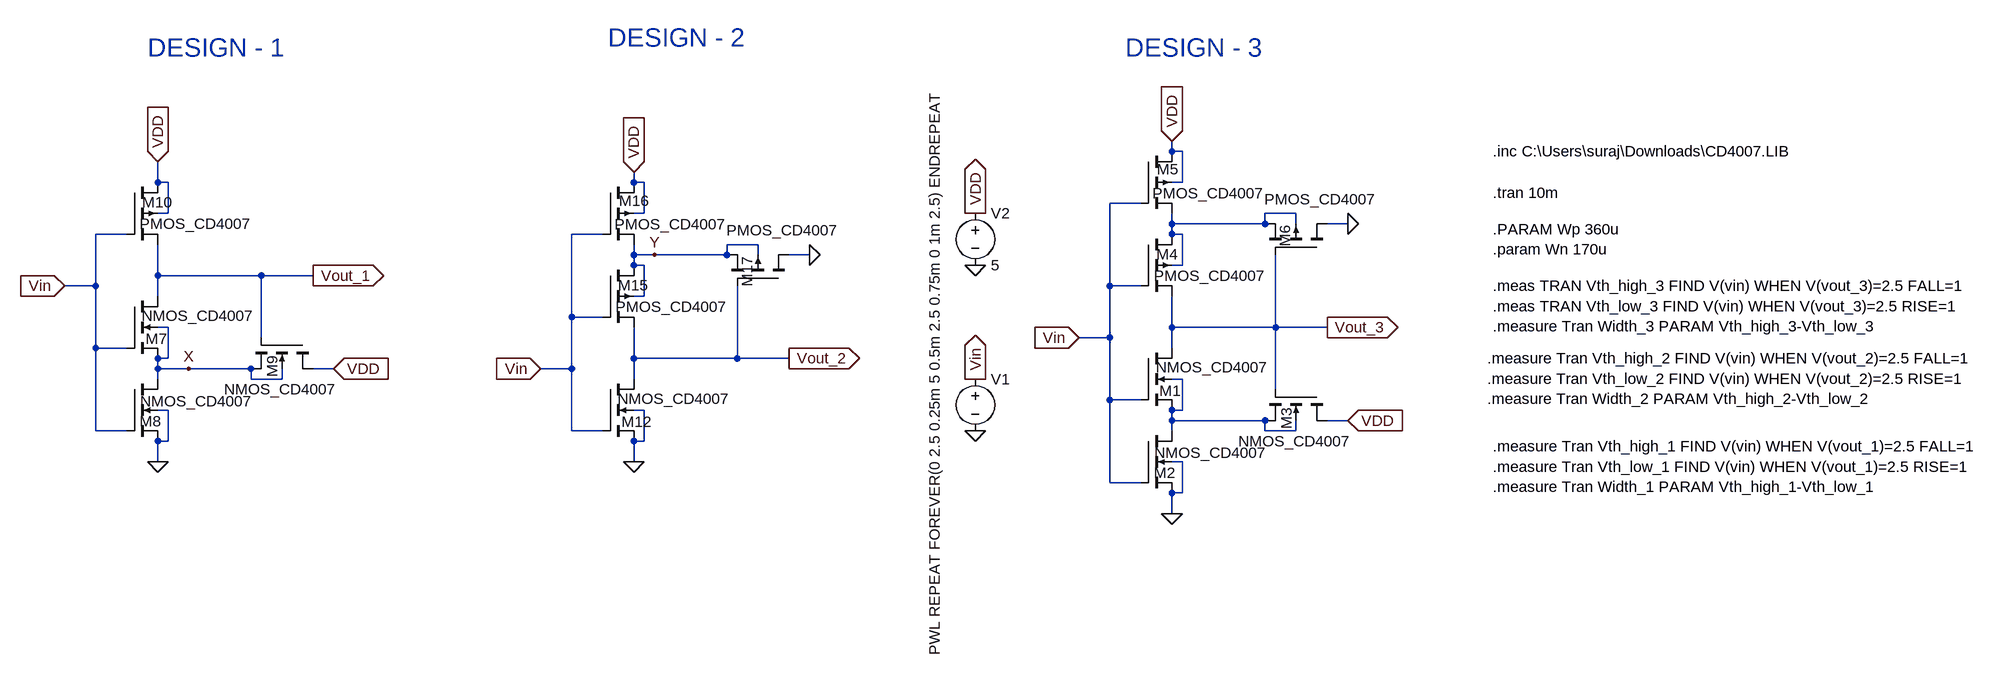
[diagram p0: schematic Schmitt_CD4007.asc]
Schmitt_CD4007.asc, the LTspice schematic file:
Version 4
SHEET 1 1564 1032
WIRE 176 -160 176 -176
WIRE 192 -160 176 -160
WIRE -1392 -112 -1392 -144
WIRE -1376 -112 -1392 -112
WIRE -656 -112 -656 -128
WIRE -640 -112 -656 -112
WIRE 192 -112 192 -160
WIRE 192 -112 176 -112
WIRE 128 -80 80 -80
WIRE -1376 -64 -1376 -112
WIRE -1376 -64 -1392 -64
WIRE -640 -64 -640 -112
WIRE -640 -64 -656 -64
WIRE 368 -64 320 -64
WIRE 176 -48 176 -64
WIRE 320 -48 320 -64
WIRE 320 -48 176 -48
WIRE 368 -48 368 -64
WIRE 448 -48 416 -48
WIRE -1440 -32 -1488 -32
WIRE -704 -32 -752 -32
WIRE 176 -32 176 -48
WIRE 192 -32 176 -32
WIRE -464 -16 -512 -16
WIRE -656 0 -656 -16
WIRE -624 0 -656 0
WIRE -512 0 -512 -16
WIRE -512 0 -624 0
WIRE -464 0 -464 -16
WIRE -384 0 -416 0
WIRE -656 16 -656 0
WIRE -640 16 -656 16
WIRE 192 16 192 -32
WIRE 192 16 176 16
WIRE -1392 32 -1392 -16
WIRE -1232 32 -1392 32
WIRE -1152 32 -1232 32
WIRE -1488 48 -1488 -32
WIRE -1488 48 -1536 48
WIRE 80 48 80 -80
WIRE 128 48 80 48
WIRE -1392 64 -1392 32
WIRE -640 64 -640 16
WIRE -640 64 -656 64
WIRE -752 96 -752 -32
WIRE -704 96 -752 96
WIRE -1376 112 -1392 112
WIRE 176 112 176 64
WIRE 336 112 336 0
WIRE 336 112 176 112
WIRE 416 112 336 112
WIRE -1232 128 -1232 32
WIRE 80 128 80 48
WIRE 80 128 32 128
WIRE -1488 144 -1488 48
WIRE -1440 144 -1488 144
WIRE 176 144 176 112
WIRE -1376 160 -1376 112
WIRE -1376 160 -1392 160
WIRE -656 160 -656 112
WIRE -496 160 -496 48
WIRE -496 160 -656 160
WIRE -416 160 -496 160
WIRE -1392 176 -1392 160
WIRE -1344 176 -1392 176
WIRE -1248 176 -1344 176
WIRE -1120 176 -1152 176
WIRE -752 176 -752 96
WIRE -752 176 -800 176
WIRE -1392 192 -1392 176
WIRE -1248 192 -1248 176
WIRE -1200 192 -1200 176
WIRE -1200 192 -1248 192
WIRE -656 192 -656 160
WIRE 192 192 176 192
WIRE 336 208 336 112
WIRE 80 224 80 128
WIRE 128 224 80 224
WIRE -1376 240 -1392 240
WIRE -640 240 -656 240
WIRE 192 240 192 192
WIRE 192 240 176 240
WIRE 176 256 176 240
WIRE 320 256 176 256
WIRE 448 256 416 256
WIRE -1488 272 -1488 144
WIRE -1440 272 -1488 272
WIRE -752 272 -752 176
WIRE -704 272 -752 272
WIRE 176 272 176 256
WIRE 320 272 320 256
WIRE 368 272 368 256
WIRE 368 272 320 272
WIRE -1376 288 -1376 240
WIRE -1376 288 -1392 288
WIRE -640 288 -640 240
WIRE -640 288 -656 288
WIRE -1392 320 -1392 288
WIRE -656 320 -656 288
WIRE 192 320 176 320
WIRE 80 352 80 224
WIRE 128 352 80 352
WIRE 192 368 192 320
WIRE 192 368 176 368
WIRE 176 400 176 368
FLAG 176 400 0
FLAG 448 -48 0
FLAG 448 256 VDD
IOPIN 448 256 In
FLAG 176 -176 VDD
IOPIN 176 -176 In
FLAG 416 112 Vout_3
IOPIN 416 112 Out
FLAG -128 16 0
FLAG -128 -64 VDD
IOPIN -128 -64 Out
FLAG 32 128 Vin
IOPIN 32 128 In
FLAG -128 272 0
FLAG -128 192 Vin
IOPIN -128 192 Out
FLAG -1392 320 0
FLAG -1120 176 VDD
IOPIN -1120 176 In
FLAG -1152 32 Vout_1
IOPIN -1152 32 Out
FLAG -1536 48 Vin
IOPIN -1536 48 In
FLAG -384 0 0
FLAG -656 -128 VDD
IOPIN -656 -128 In
FLAG -416 160 Vout_2
IOPIN -416 160 Out
FLAG -800 176 Vin
IOPIN -800 176 In
FLAG -1392 -144 VDD
IOPIN -1392 -144 In
FLAG -1344 176 X
FLAG -656 320 0
FLAG -624 0 Y
SYMBOL nmos4 128 144 R0
WINDOW 0 29 66 Left 2
WINDOW 3 23 30 Left 2
SYMATTR InstName M1
SYMATTR Value NMOS_CD4007
SYMATTR Value2 l=5u w=Wn
SYMBOL nmos4 128 272 R0
WINDOW 0 20 65 Left 2
WINDOW 3 21 34 Left 2
SYMATTR InstName M2
SYMATTR Value NMOS_CD4007
SYMATTR Value2 l=5u w=Wn
SYMBOL nmos4 416 208 R90
WINDOW 0 28 63 Left 2
WINDOW 3 80 -37 VRight 2
SYMATTR InstName M3
SYMATTR Value NMOS_CD4007
SYMATTR Value2 l=5u w=Wn
SYMBOL pmos4 128 -32 R0
WINDOW 0 24 31 Left 2
WINDOW 3 20 64 Left 2
SYMATTR InstName M4
SYMATTR Value PMOS_CD4007
SYMATTR Value2 l=5u w=Wp
SYMBOL pmos4 128 -160 R0
WINDOW 0 25 28 Left 2
WINDOW 3 18 65 Left 2
SYMATTR InstName M5
SYMATTR Value PMOS_CD4007
SYMATTR Value2 l=5u w=Wp
SYMBOL pmos4 416 0 M270
WINDOW 0 46 65 Right 2
WINDOW 3 86 97 VLeft 2
SYMATTR InstName M6
SYMATTR Value PMOS_CD4007
SYMATTR Value2 l=5u w=Wp
SYMBOL voltage -128 -80 R0
WINDOW 123 0 0 Left 0
WINDOW 39 0 0 Left 0
SYMATTR InstName V2
SYMATTR Value 5
SYMBOL voltage -128 176 R0
WINDOW 3 -63 -427 VRight 2
SYMATTR Value PWL REPEAT FOREVER(0 2.5 0.25m 5 0.5m 2.5 0.75m 0 1m 2.5) ENDREPEAT
SYMATTR InstName V1
SYMBOL nmos4 -1440 64 R0
WINDOW 0 29 66 Left 2
WINDOW 3 23 30 Left 2
SYMATTR InstName M7
SYMATTR Value NMOS_CD4007
SYMATTR Value2 l=5u w=Wn
SYMBOL nmos4 -1440 192 R0
WINDOW 0 20 65 Left 2
WINDOW 3 21 34 Left 2
SYMATTR InstName M8
SYMATTR Value NMOS_CD4007
SYMATTR Value2 l=5u w=Wn
SYMBOL nmos4 -1152 128 R90
WINDOW 0 28 63 Left 2
WINDOW 3 80 -37 VRight 2
SYMATTR InstName M9
SYMATTR Value NMOS_CD4007
SYMATTR Value2 l=5u w=Wn
SYMBOL pmos4 -1440 -112 R0
WINDOW 0 24 31 Left 2
WINDOW 3 20 64 Left 2
SYMATTR InstName M10
SYMATTR Value PMOS_CD4007
SYMATTR Value2 l=5u w=Wp
SYMBOL nmos4 -704 192 R0
WINDOW 0 29 66 Left 2
WINDOW 3 23 30 Left 2
SYMATTR InstName M12
SYMATTR Value NMOS_CD4007
SYMATTR Value2 l=5u w=170u
SYMBOL pmos4 -704 16 R0
WINDOW 0 24 31 Left 2
WINDOW 3 20 64 Left 2
SYMATTR InstName M15
SYMATTR Value PMOS_CD4007
SYMATTR Value2 l=5u w=Wp
SYMBOL pmos4 -704 -112 R0
WINDOW 0 25 28 Left 2
WINDOW 3 18 65 Left 2
SYMATTR InstName M16
SYMATTR Value PMOS_CD4007
SYMATTR Value2 l=5u w=Wp
SYMBOL pmos4 -416 48 M270
WINDOW 0 46 65 Right 2
WINDOW 3 86 97 VLeft 2
SYMATTR InstName M17
SYMATTR Value PMOS_CD4007
SYMATTR Value2 l=5u w=Wp
TEXT 672 -96 Left 2 !.tran 10m
TEXT 672 -160 Left 2 !.inc C:\\Users\\suraj\\Downloads\\CD4007.LIB
TEXT 672 48 Left 2 !.meas TRAN Vth_high_3 FIND V(vin) WHEN V(vout_3)=2.5 FALL=1\n.meas TRAN Vth_low_3 FIND V(vin) WHEN V(vout_3)=2.5 RISE=1\n.measure Tran Width_3 PARAM Vth_high_3-Vth_low_3
TEXT 664 160 Left 2 !.measure Tran Vth_high_2 FIND V(vin) WHEN V(vout_2)=2.5 FALL=1\n.measure Tran Vth_low_2 FIND V(vin) WHEN V(vout_2)=2.5 RISE=1\n.measure Tran Width_2 PARAM Vth_high_2-Vth_low_2
TEXT 672 296 Left 2 !.measure Tran Vth_high_1 FIND V(vin) WHEN V(vout_1)=2.5 FALL=1\n.measure Tran Vth_low_1 FIND V(vin) WHEN V(vout_1)=2.5 RISE=1\n.measure Tran Width_1 PARAM Vth_high_1-Vth_low_1
TEXT 672 -40 Left 2 !.PARAM Wp 360u\n.param Wn 170u
TEXT -1408 -320 Left 4 ;DESIGN - 1
TEXT -696 -336 Left 4 ;DESIGN - 2
TEXT 104 -320 Left 4 ;DESIGN - 3

The netlist it stands for:
* Schmitt_CD4007.asc
M1 Vout_3 Vin N002 N002 NMOS_CD4007 l=5u w=Wn
M2 N002 Vin 0 0 NMOS_CD4007 l=5u w=Wn
M3 VDD Vout_3 N002 N002 NMOS_CD4007 l=5u w=Wn
M4 N001 Vin Vout_3 N001 PMOS_CD4007 l=5u w=Wp
M5 VDD Vin N001 VDD PMOS_CD4007 l=5u w=Wp
M6 0 Vout_3 N001 N001 PMOS_CD4007 l=5u w=Wp
V2 VDD 0 5
V1 Vin 0 PWL REPEAT FOREVER(0 2.5 0.25m 5 0.5m 2.5 0.75m 0 1m 2.5) ENDREPEAT
M7 Vout_1 Vin X X NMOS_CD4007 l=5u w=Wn
M8 X Vin 0 0 NMOS_CD4007 l=5u w=Wn
M9 VDD Vout_1 X X NMOS_CD4007 l=5u w=Wn
M10 VDD Vin Vout_1 VDD PMOS_CD4007 l=5u w=Wp
M12 Vout_2 Vin 0 0 NMOS_CD4007 l=5u w=170u
M15 Y Vin Vout_2 Y PMOS_CD4007 l=5u w=Wp
M16 VDD Vin Y VDD PMOS_CD4007 l=5u w=Wp
M17 0 Vout_2 Y Y PMOS_CD4007 l=5u w=Wp
.model NMOS NMOS
.model PMOS PMOS
.lib standard.mos
.tran 10m
.inc C:\Users\suraj\Downloads\CD4007.LIB
.meas TRAN Vth_high_3 FIND V(vin) WHEN V(vout_3)=2.5 FALL=1
.meas TRAN Vth_low_3 FIND V(vin) WHEN V(vout_3)=2.5 RISE=1
.measure Tran Width_3 PARAM Vth_high_3-Vth_low_3
.measure Tran Vth_high_2 FIND V(vin) WHEN V(vout_2)=2.5 FALL=1
.measure Tran Vth_low_2 FIND V(vin) WHEN V(vout_2)=2.5 RISE=1
.measure Tran Width_2 PARAM Vth_high_2-Vth_low_2
.measure Tran Vth_high_1 FIND V(vin) WHEN V(vout_1)=2.5 FALL=1
.measure Tran Vth_low_1 FIND V(vin) WHEN V(vout_1)=2.5 RISE=1
.measure Tran Width_1 PARAM Vth_high_1-Vth_low_1
.PARAM Wp 360u
.param Wn 170u
* DESIGN - 1
* DESIGN - 2
* DESIGN - 3
.backanno
.end